# Altium schematic sheet video_in_gps_mems.SchDoc
size A4
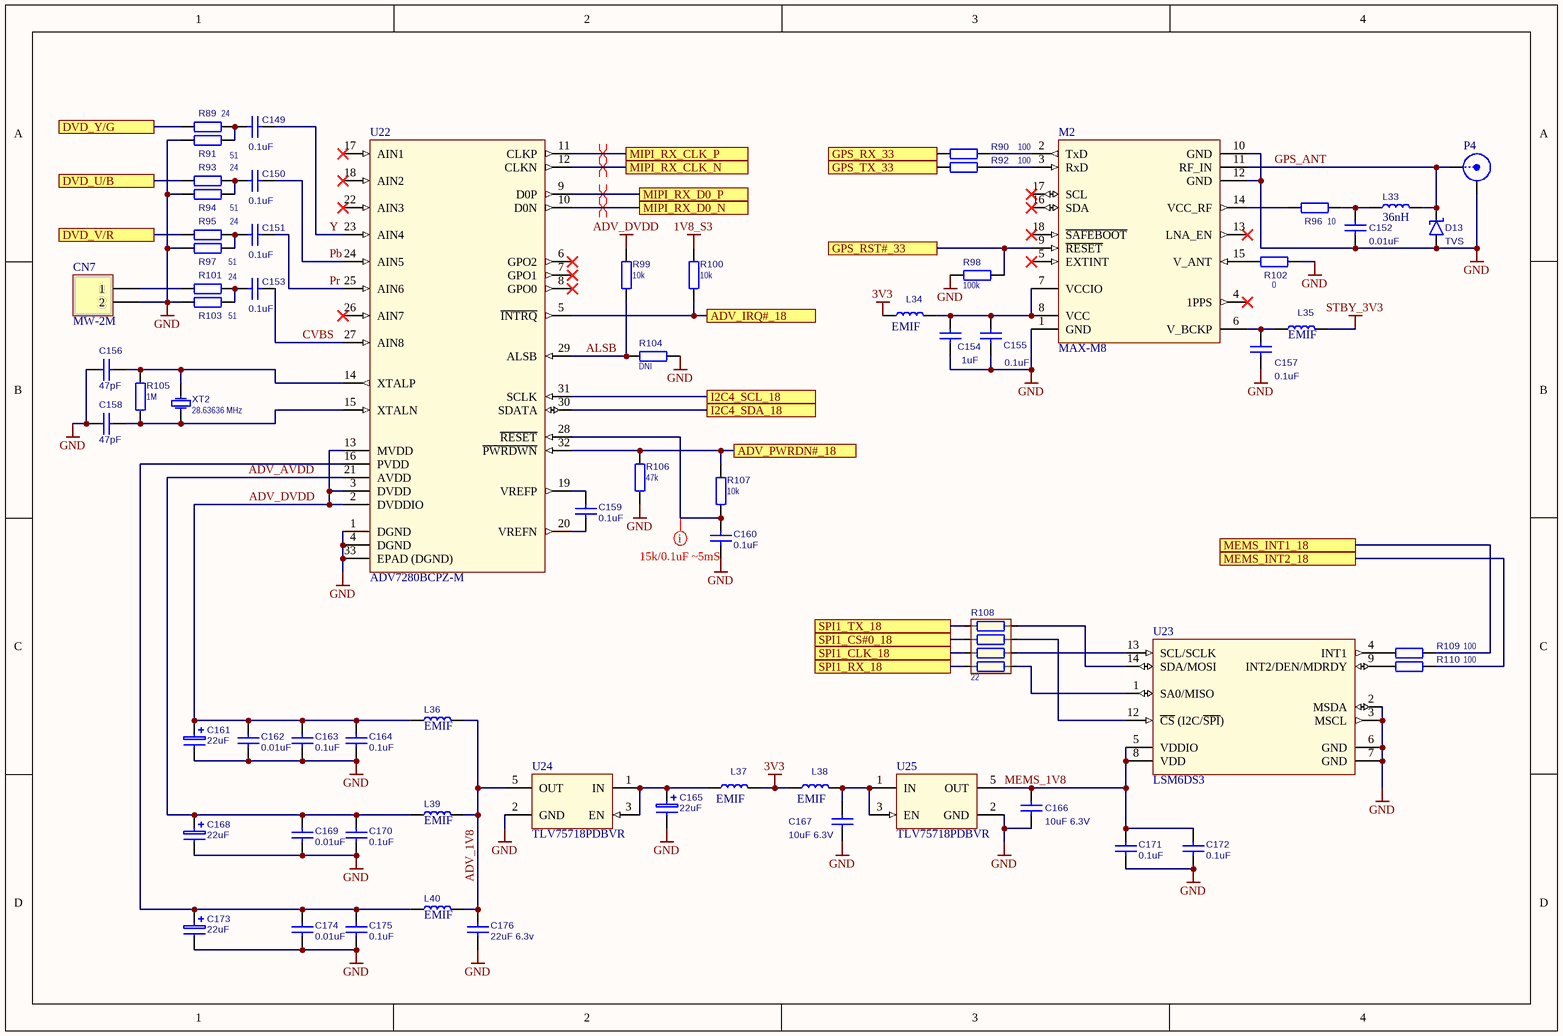
[diagram p0: video_in_gps_mems.SchDoc]

## Parts
C149  value 0.1uF  [C0603]  (hidden comment: C1608X7R1H104K080AA)
C150  value 0.1uF  [C0603]  (hidden comment: C1608X7R1H104K080AA)
C151  value 0.1uF  [C0603]  (hidden comment: C1608X7R1H104K080AA)
C152  value 0.01uF  [C0603]  (hidden comment: CL10B103KB8NNNC)
C153  value 0.1uF  [C0603]  (hidden comment: C1608X7R1H104K080AA)
C154  value 1uF  [C0603]  (hidden comment: CC0603KRX7R9BB105)
C155  value 0.1uF  [C0603]  (hidden comment: C1608X7R1H104K080AA)
C156  value 47pF  [C0603]  (hidden comment: CC0603JRNPO9BN470)
C157  value 0.1uF  [C0603]  (hidden comment: C1608X7R1H104K080AA)
C158  value 47pF  [C0603]  (hidden comment: CC0603JRNPO9BN470)
C159  value 0.1uF  [C0603]  (hidden comment: C1608X7R1H104K080AA)
C160  value 0.1uF  [C0603]  (hidden comment: C1608X7R1H104K080AA)
C161  value 22uF  [TANTAL-A-1206]  (hidden comment: 293D226X9010A2TE3)
C162  value 0.01uF  [C0603]  (hidden comment: CL10B103KB8NNNC)
C163  value 0.1uF  [C0603]  (hidden comment: C1608X7R1H104K080AA)
C164  value 0.1uF  [C0603]  (hidden comment: C1608X7R1H104K080AA)
C165  value 22uF  [TANTAL-A-1206]  (hidden comment: 293D226X9010A2TE3)
C166  value 10uF 6.3V  [C0603]  (hidden comment: CC0603MRX5R5BB106)
C167  value 10uF 6.3V  [C0603]  (hidden comment: CC0603MRX5R5BB106)
C168  value 22uF  [TANTAL-A-1206]  (hidden comment: 293D226X9010A2TE3)
C169  value 0.01uF  [C0603]  (hidden comment: CL10B103KB8NNNC)
C170  value 0.1uF  [C0603]  (hidden comment: C1608X7R1H104K080AA)
C171  value 0.1uF  [C0603]  (hidden comment: C1608X7R1H104K080AA)
C172  value 0.1uF  [C0603]  (hidden comment: C1608X7R1H104K080AA)
C173  value 22uF  [TANTAL-A-1206]  (hidden comment: 293D226X9010A2TE3)
C174  value 0.01uF  [C0603]  (hidden comment: CL10B103KB8NNNC)
C175  value 0.1uF  [C0603]  (hidden comment: C1608X7R1H104K080AA)
C176  value 22uF 6.3v  [C0805]  (hidden comment: CL21A226MQQNNNE)
CN7  MW-2M  [MW-2M]
D13  value TVS  [SOD-323]  (hidden comment: CDSOD323-T05LC)
L33  value 36nH  [IND0603]  (hidden comment: LQW18AN36NG00D)
L34  value EMIF  [IND0603]  (hidden comment: BLM18AG102SN1D)
L35  value EMIF  [IND0603]  (hidden comment: BLM18AG102SN1D)
L36  value EMIF  [IND0603]  (hidden comment: BLM18AG102SN1D)
L37  value EMIF  [IND0603]  (hidden comment: BLM18AG102SN1D)
L38  value EMIF  [IND0603]  (hidden comment: BLM18AG102SN1D)
L39  value EMIF  [IND0603]  (hidden comment: BLM18AG102SN1D)
L40  value EMIF  [IND0603]  (hidden comment: BLM18AG102SN1D)
M2  MAX-M8  [MAX-M8]
P4  I-PEX  [I-PEX]  (value not drawn)
R89  24  [R0603]
R90  100  [R0603]
R91  51  [R0603]
R92  100  [R0603]
R93  24  [R0603]
R94  51  [R0603]
R95  24  [R0603]
R96  10  [R0603]
R97  51  [R0603]
R98  100k  [R0603]
R99  10k  [R0603]
R100  10k  [R0603]
R101  24  [R0603]
R102  0  [R0603]
R103  51  [R0603]
R104  DNI  [R0603]
R105  1M  [R0603]
R106  47k  [R0603]
R107  10k  [R0603]
R108  value 22  [R0804X4]  (hidden comment: TC124-JR-0722RL)
R109  100  [R0603]
R110  100  [R0603]
U22  ADV7280BCPZ-M  [CP-32-12]
U23  LSM6DS3  [LGA-14 (2.5x3.0x0.86)]
U24  TLV75718PDBVR  [SOT-23-5]
U25  TLV75718PDBVR  [SOT-23-5]
XT2  28.63636 MHz  [HC-49/S-SMD]

## Ports
ADV_IRQ#_18, ADV_PWRDN#_18, DVD_U/B, DVD_V/R, DVD_Y/G, GPS_RST#_33, GPS_RX_33, GPS_TX_33, I2C4_SCL_18, I2C4_SDA_18, MEMS_INT1_18, MEMS_INT2_18, MIPI_RX_CLK_N, MIPI_RX_CLK_P, MIPI_RX_D0_N, MIPI_RX_D0_P, SPI1_CLK_18, SPI1_CS#0_18, SPI1_RX_18, SPI1_TX_18

## Nets
1V8_S3: R100.2
3V3: L34.1 L37.2 L38.1
ADV_DVDD: C161.1(+) C162.1 C163.1 C164.1 L36.1 R99.2 U22.2(DVDDIO) U22.3(DVDD) U22.13(MVDD)
GND: C152.2 C154.1 C155.2 C156.2 C157.2 C158.2 C160.2 C161.2(-) C162.2 C163.2 C164.2 C165.2(-) C166.2 C167.2 C168.2(-) C169.2 C170.2 C171.2 C172.2 C173.2(-) C174.2 C175.2 C176.1 CN7.2 D13.1(A) M2.1(GND) M2.10(GND) M2.12(GND) P4.2(Y) R91.1 R94.1 R97.1 R98.1 R102.1 R103.1 R104.1 R106.1 U22.1(DGND) U22.4(DGND) U22.33(EPAD_(DGND)) U23.2(MSDA) U23.3(MSCL) U23.6(GND) U23.7(GND) U24.2(GND) U25.2(GND)
STBY_3V3: L35.2
ADV_1V8: C176.2 L36.2 L39.2 L40.2 U24.5(OUT)
ADV_AVDD: C168.1(+) C169.1 C170.1 L39.1 U22.21(AVDD)
ADV_IRQ#_18: R100.1 U22.5(~{INTRQ}) ; port ADV_IRQ#_18
ADV_PWRDN#_18: R106.2 R107.1 U22.32(~{PWRDWN}) ; port ADV_PWRDN#_18
ALSB: R99.1 R104.2 U22.29(ALSB)
CVBS: C153.1 U22.27(AIN8)
DVD_U/B: R93.2 ; port DVD_U/B
DVD_V/R: R95.2 ; port DVD_V/R
DVD_Y/G: R89.2 ; port DVD_Y/G
GPS_ANT: D13.2(K) L33.2 M2.11(RF_IN) P4.1(X)
GPS_RST#_33: M2.9(~{RESET}) R98.2 ; port GPS_RST#_33
GPS_RX_33: R90.2 ; port GPS_RX_33
GPS_TX_33: R92.2 ; port GPS_TX_33
I2C4_SCL_18: U22.31(SCLK) ; port I2C4_SCL_18
I2C4_SDA_18: U22.30(SDATA) ; port I2C4_SDA_18
MEMS_1V8: C166.1 C171.1 C172.1 U23.5(VDDIO) U23.8(VDD) U25.5(OUT)
MEMS_INT1_18: R109.1 ; port MEMS_INT1_18
MEMS_INT2_18: R110.1 ; port MEMS_INT2_18
MIPI_RX_CLK_N: U22.12(CLKN) ; port MIPI_RX_CLK_N
MIPI_RX_CLK_P: U22.11(CLKP) ; port MIPI_RX_CLK_P
MIPI_RX_D0_N: U22.10(D0N) ; port MIPI_RX_D0_N
MIPI_RX_D0_P: U22.9(D0P) ; port MIPI_RX_D0_P
Pb: C150.1 U22.24(AIN5)
Pr: C151.1 U22.25(AIN6)
SPI1_CLK_18: R108.3 ; port SPI1_CLK_18
SPI1_CS#0_18: R108.5 ; port SPI1_CS#0_18
SPI1_RX_18: R108.1 ; port SPI1_RX_18
SPI1_TX_18: R108.7 ; port SPI1_TX_18
Y: C149.1 U22.23(AIN4)
NetC149_2: C149.2 R89.1 R91.2
NetC150_2: C150.2 R93.1 R94.2
NetC151_2: C151.2 R95.1 R97.2
NetC152_1: C152.1 L33.1 R96.1
NetC153_2: C153.2 R101.1 R103.2
NetC154_2: C154.2 C155.1 L34.2 M2.7(VCCIO) M2.8(VCC)
NetC156_1: C156.1 R105.1 U22.14(XTALP) XT2.1
NetC157_1: C157.1 L35.1 M2.6(V_BCKP)
NetC158_1: C158.1 R105.2 U22.15(XTALN) XT2.2
NetC159_1: C159.1 U22.19(VREFP)
NetC159_2: C159.2 U22.20(VREFN)
NetC160_1: C160.1 R107.2 U22.28(~{RESET})
NetC165_1: C165.1(+) L37.1 U24.1(IN) U24.3(EN)
NetC167_1: C167.1 L38.2 U25.1(IN) U25.3(EN)
NetC173_1: C173.1(+) C174.1 C175.1 L40.1 U22.16(PVDD)
NetCN7_1: CN7.1 R101.2
NetM2_2: M2.2(TxD) R90.1
NetM2_3: M2.3(RxD) R92.1
NetM2_14: M2.14(VCC_RF) R96.2
NetM2_15: M2.15(V_ANT) R102.2
NetR108_2: R108.2 U23.1(SA0/MISO)
NetR108_4: R108.4 U23.13(SCL/SCLK)
NetR108_6: R108.6 U23.12(~{CS}_(I2C/~{SPI}))
NetR108_8: R108.8 U23.14(SDA/MOSI)
NetR109_2: R109.2 U23.4(INT1)
NetR110_2: R110.2 U23.9(INT2/DEN/MDRDY)

Not connected (* = marked no-connect by the designer): M2 4(1PPS)* 5(EXTINT)* 13(LNA_EN)* 16(SDA)* 17(SCL)* 18(~{SAFEBOOT})*; U22 6(GPO2)* 7(GPO1)* 8(GPO0)* 17(AIN1)* 18(AIN2)* 22(AIN3)* 26(AIN7)*

## Layout directives
mark named 15k/0.1uF ~5mS: NetC160_1
differential pair: MIPI_RX_CLK_N, MIPI_RX_CLK_P, MIPI_RX_D0_N, MIPI_RX_D0_P

## Library data of the parts
C149-C160 C162-C164 C166 C167 C169-C172 C174-C176 = CAP_NPOL
C161 C165 C168 C173 = CAP_POL
CN7 = HDR 2: Header, 2-Pin; LatestRevisionDate: 17-Jul-2002; LatestRevisionNote: Re-released for DXP Platform.; Publisher: Altium Limited
D13 = SHOTTKY
L33-L40 = IND_WO_IRON
M2 = MAX-M8: MAX-M8 concurrent GNSS modules; value: NEO-M8
P4 = BNC: LatestRevisionDate: 17-Jul-2002; LatestRevisionNote: Re-released for DXP Platform.; Publisher: Altium Limited
R89-R107 R109 R110 = RESISTOR: RES
  R89 R93 R95 R101: Value: 24
  R90 R92 R109 R110: Value: 100
  R91 R94 R97 R103: Value: 51
  R96: Value: 10
  R98: Value: 100k
  R99 R100 R107: Value: 10k
  R102: Value: 0
  R104: Value: DNI
  R105: Value: 1M
  R106: Value: 47k
R108 = ARRAY
U22 = ADV7280BCPZ-M: 10-Bit, 4xOversampling SDTV Video Decoder; Value: ADV7280BCPZ-M
U23 = LSM6DS3: iNEMO inertial module: / always-on 3D accelerometer and 3D gyroscope; value: LSM9DS0
U24 U25 = TLV733P: Capacitor-Free, 300-mA, Low-Dropout Regulator with Foldback Current Limit for Portable Devices; value: TLV733P
XT2 = XTAL: Value: 28.63636 MHz